# EAGLE design superslowclock (EAGLE 5.10)
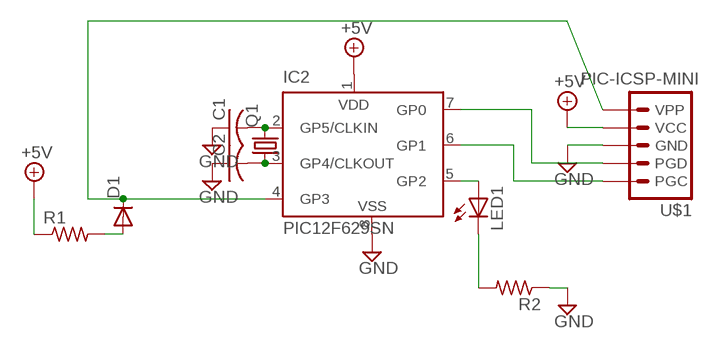
[diagram p0: schematic, sheet 1]

## Parts
C1  C-USC1206  [C1206]
C2  C-USC1206  [C1206]
D1  DIODE-DO214AA  [DO214AA]
IC2  PIC12F629SN  [SO-08]
LED1  LEDCHIPLED-0603-TTW  [CHIPLED-0603-TTW]
Q1  CRYSTALTC26H  [TC26H]
R1  R-US_M0805  [M0805]
R2  R-US_R0603  [R0603]
U$1  PIC-ICSP-MINI  [PIC-ICSP-MINI]

## Nets
+5V: IC2.1(VDD) R1.1 U$1.2(VCC)
GND: C1.1 C2.1 IC2.8(VSS) R2.1 U$1.3(GND)
N$1: IC2.7(GP0) U$1.4(PGD)
N$2: IC2.6(GP1) U$1.5(PGC)
N$3: D1.C IC2.4(GP3) U$1.1(VPP)
N$4: C1.2 IC2.2(GP5/CLKIN) Q1.2
N$5: C2.2 IC2.3(GP4/CLKOUT) Q1.1
N$7: D1.A R1.2
N$9: IC2.5(GP2) LED1.A@1(A)
N$10: LED1.C@1(C) R2.2

## Library data of the parts
C1 C2 = rcl:C-US: CAPACITOR, American symbol
D1 = diode:DIODE-: DIODE
IC2 = microchip:PIC12F6*: Data Sheet 8-Pin FLASH-Based 8-Bit CMOS Microcontrollers Source: http://www.microchip.com .. 41190c.pdf; MF: MICROCHIP; MPN: PIC12F629-I/SN; OC_FARNELL: 9759000; OC_NEWARK: 61K3433
LED1 = led:LED: LED OSRAM: - CHIPLED LG R971, LG N971, LY N971, LG Q971, LY Q971, LO R971, LY R971 LH N974, LH R974 LS Q976, LO Q976, LY Q976 LO Q996 - Hyper CHIPLED LW Q18S LB Q993, LB Q99A, LB R99A - SideLED LS A670, LO A670, LY A670, LG A670, LP A670 LB A673, LV A673, LT A673, LW A673 LH A674 LY A675 LS A676, LA A676, LO A676, LY A676, LW A676 LS A679, LY A679, LG A679 - Hyper Micro SIDELED® LS Y876, LA Y876, LO Y876, LY Y876 LT Y87S - SmartLED LW L88C, LW L88S LB L89C, LB L89S, LG L890 LS L89K, LO L89K, LY L89K LS L896, LA L896, LO L896, LY L896 - TOPLED LS T670, LO T670, LY T670, LG T670, LP T670 LSG T670, LSP T670, LSY T670, LOP T670, LYG T670 LG T671, LOG T671, LSG T671 LB T673, LV T673, LT T673, LW T673 LH T674 LS T676, LA T676, LO T676, LY T676, LB T676, LH T676, LSB T676, LW T676 LB T67C, LV T67C, LT T67C, LS T67K, LO T67K, LY T67K, LW E67C LS E67B, LA E67B, LO E67B, LY E67B, LB E67C, LV E67C, LT E67C LW T67C LS T679, LY T679, LG T679 LS T770, LO T770, LY T770, LG T770, LP T770 LB T773, LV T773, LT T773, LW T773 LH T774 LS E675, LA E675, LY E675, LS T675 LS T776, LA T776, LO T776, LY T776, LB T776 LHGB T686 LT T68C, LB T68C - Hyper Mini TOPLED® LB M676 - Mini TOPLED Santana® LG M470 LS M47K, LO M47K, LY M47K Source: http://www.osram.convergy.de LUXEON: - LUMILED® LXK2-PW12-R00, LXK2-PW12-S00, LXK2-PW14-U00, LXK2-PW14-V00 LXK2-PM12-R00, LXK2-PM12-S00, LXK2-PM14-U00 LXK2-PE12-Q00, LXK2-PE12-R00, LXK2-PE12-S00, LXK2-PE14-T00, LXK2-PE14-U00 LXK2-PB12-K00, LXK2-PB12-L00, LXK2-PB12-M00, LXK2-PB14-N00, LXK2-PB14-P00, LXK2-PB14-Q00 LXK2-PR12-L00, LXK2-PR12-M00, LXK2-PR14-Q00, LXK2-PR14-R00 LXK2-PD12-Q00, LXK2-PD12-R00, LXK2-PD12-S00 LXK2-PH12-R00, LXK2-PH12-S00 LXK2-PL12-P00, LXK2-PL12-Q00, LXK2-PL12-R00 Source: www.luxeon.com KINGBRIGHT: KA-3528ASYC Source: www.kingbright.com
Q1 = crystal:CRYSTAL: CRYSTAL; OC_FARNELL: unknown; OC_NEWARK: unknown
R1 R2 = resistor:R-US_: RESISTOR, American symbol
U$1 = SparkFun:PIC-ICSP-MINI: PIC-ICSP-Mini Miniature 5-pin connection for temporary programming of PICs. Use this device in your design to save space. Program the PIC with this adapter Spark Fun Electronics SKU : BOB-00194

## Board
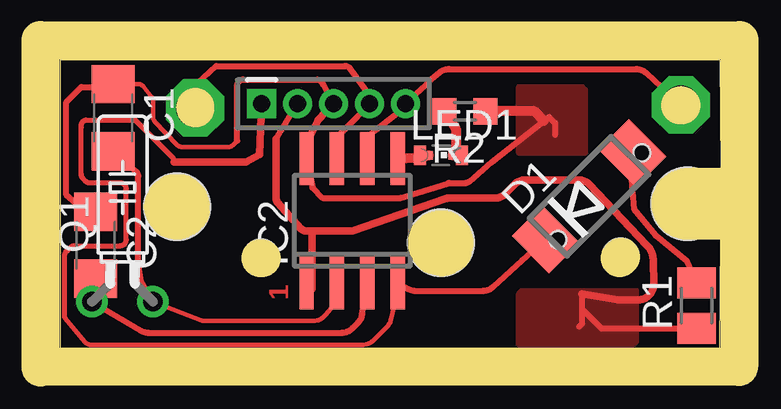
[diagram p1: board, top side]

Size 27.53 x 12 mm. Coordinates in mm from the lower left corner, seen from the top.
Outline: 0,0 27.5,0 27.53,4.54 arc-180 27.53,7.5 27.5,12 0,12 0,0
Copper layers (1*16): Top 0.035mm / dielectric 1.5mm / Bottom 0.035mm
Design rules "default *": minimum track width 10mil, minimum drill 0.5mm, track to track 9mil, track to pad 9mil, pad to pad 9mil, via to via 9mil, smd to smd 0mil, copper to edge 1mil, drill to drill 8mil, minimum pad ring 10mil, minimum via ring 8mil, stop-mask expansion 4mil, vias tented up to drill 0mil, thermal gap 10mil
Holes 1.5 mm at 8.38,3.75 23.37,3.79
Holes 2.75 mm at 4.88,5.88 15.88,4.38
Holes 3 mm at 26.16,6
Holes 0.7 mm at 20.75,4.5 24.25,8.12
Milling: 87 lines

### Footprints (pad centres in the part's own frame; a part is rotated, then mirrored left to right if it is on the bottom)
C1206 = smd 1.6 x 1.8: 1 -1.4,0; 2 1.4,0
DO214AA = smd 1.8 x 2.2: A 2.55,0; C -2.55,0
SO-08 = smd 0.6 x 2.2: 1 -1.905,-2.6; 2 -0.635,-2.6; 3 0.635,-2.6; 4 1.905,-2.6; 5 1.905,2.6; 6 0.635,2.6; 7 -0.635,2.6; 8 -1.905,2.6
CHIPLED-0603-TTW = smd 0.8 x 0.5: A 0,-0.875; C 0,0.875 | smd 0.35 x 0.35: A@1 0,-0.5; C@1 0,0.5
TC26H = drill 0.813 round: 1 -1.27,0; 2 1.27,0
M0805 = smd 1.3 x 1.6: 1 -0.95,0; 2 0.95,0
R0603 = smd 1 x 1.1: 1 -0.85,0; 2 0.85,0
PIC-ICSP-MINI = drill 0.7 square: 1 -3,0 | drill 0.7 round: 2 -1.5,0; 3 0,0; 4 1.5,0; 5 3,0

### Placement (x,y rotation side)
C1  2.21,9.59 270 top
C2  1.48,4.28 270 top
D1  22.05,6.32 45 top
IC2  12.17,5.29 0 top
LED1  15.86,8.03 270 top
Q1  2.6,1.92 0 top
R1  26.53,1.75 90 top
R2  16.87,9.86 180 top
U$1  11.39,10.18 0 top

### Tracks (layer width: path | path; a pad name or v marks a point on that pad's centre or on a via)
+5V
  Top 0.254: 10.5,2.46 IC2.1 | 9,8.7 U$1.2 | 21.75,2.25 21.75,1.62 | 21.75,1.62 21.75,1 21.62,0.88 | R1.1 22.57,0.81 21.75,1.62
  Top 0.305: 10.5,4.88 10.5,2.46 | 10.5,4.88 10.24,4.88 arc-48 10.05,4.96 9.06,6.05 arc-42 9,6.22 9,8.7 | 10.5,4.88 12.19,4.88 16.09,6.21 arc-19 16.23,6.25 18.24,6.25 arc45 18.56,6.44 18.94,6.81 arc-45 19.39,7 21.61,7 arc-45 22.06,6.81 24.45,4.27 arc-45 24.72,3.68 24.75,2.62 24.73,2.51 arc-79 24.1,2 23.25,2 21.75,2.25
  pour Top: 19.25,2.38 24,2.38 24,0.25 23.88,0.12 19.12,0.12 19.12,2.25
GND
  Top 0.178: C1.1 3.25,11 arc-53 3.45,10.9 3.82,10.45 arc-39 3.88,10.29 3.88,9.6 arc44 3.94,9.43 4.87,8.45 arc46 5.06,8.38 7.02,8.38 arc45 7.2,8.45 7.38,8.62
  Top 0.254: C2.1 1.1,5.64 0.25,6.38 0.25,10.25 0.88,10.88 1.95,10.88 C1.1 | 10.39,8.77 IC2.8 10.52,6.67 10.93,6.25 14.19,6.25 16.17,6.85 arc-16 16.21,6.88 16.91,6.88 arc41 17.07,6.94 18,7.75 20.16,9.46 20.38,9.62 20.62,9.38 20.62,8.88 | U$1.3 10.95,10.99 arc61 10.72,11.19 7.62,11.19 arc90 7.38,10.88 7.38,8.62
  Top 0.305: U$1.3 10.75,9.5 10.39,8.77
  Top 0.406: R2.1 19.76,9.86 20.16,9.46
  pour Top: 19.12,8.12 19.12,10.88 21.75,10.88 21.88,10.75 21.88,8.12
N$1
  Top 0.254: IC2.7 11.39,8.54 11.62,8.88 12.38,9.62 U$1.4 13.02,10.36 12.08,11.65 arc54 11.87,11.75 6.5,11.75 5.72,11.03 arc-45 5.49,10
N$2
  Top 0.254: 26,10 24.43,11.46 arc43 24,11.62 16.22,11.62 arc39 15.83,11.49 15.38,11.12 15.25,10.95 U$1.5 14.25,9.94 13.12,9.06 12.75,8.73 12.89,7.98 IC2.6
N$3
  Top 0.178: 0.19,1.25 1.05,0.22 arc52 1.25,0.12 12.61,0.12 arc45 13.06,0.31 13.62,0.87 arc32 13.79,1.18 14.12,2.65
  Top 0.2: 4.75,7.75 4.75,7.77 arc45 4.68,7.95 3.12,9.5 1.07,9.5 arc90 0.88,9.18 0.88,7.23 arc45 0.95,7.05 1.05,6.95 arc45 1.23,6.88 2.5,6.88 arc-90 2.75,6.62 2.75,4.5 arc-90 2.5,4.25 0.6,4.25 arc45 0.43,4.18 0.32,4.07 arc45 0.19,3.9 0.19,1.25 | 14.12,2.65 IC2.4
  Top 0.254: D1.C 19.27,3.64 18.06,2.54 arc-42 17.63,2.38 14.75,2.38 14.39,2.5 IC2.4
  Top 0.305: U$1.1 8.3,8.05 7.75,7.75 4.75,7.75
N$4
  Top 0.178: Q1.2 5.87,1.14 arc21 5.96,1.12 10.57,1.12 arc51 11.07,1.36 11.41,1.79
  Top 0.254: Q1.2 3.37,2.76 3.25,3.5 3.25,7.16 arc49 3.16,7.35 C1.2 | 11.41,1.79 IC2.2
N$5
  Top 0.254: C2.2 1.23,2.69 Q1.1 3.35,0.71 arc31 3.67,0.62 11.74,0.62 arc45 12.19,0.81 12.41,1.04 arc36 12.59,1.38 IC2.3
N$6  (via drill 1.6)
  other vias: 5.62,10
N$7
  Top 0.254: D1.A 23.96,7.83 23.81,7.28 23.93,5.77 24.82,4.67 26.12,3.61 R1.2
N$8  (via drill 1.6)
  other vias: 25.88,10.12
N$9
  Top 0.406: IC2.5 15.17,7.96 LED1.A@1
N$10
  Top 0.406: LED1.C@1 16.5,8.22 16.5,9.14 R2.2

### Text on the board
Top: 1